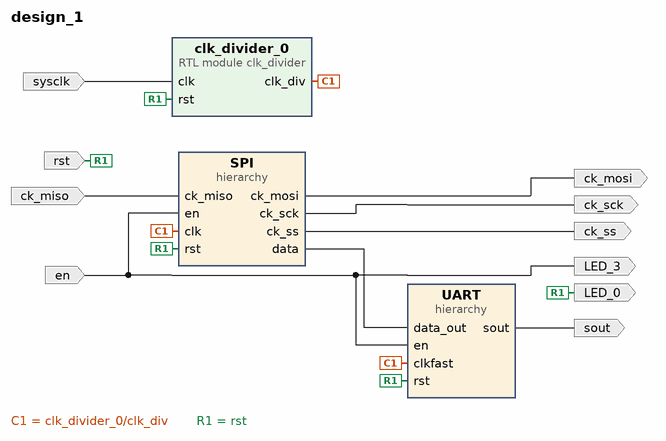
[diagram p0: block diagram of the top level]
# Vivado block design design_1, xc7z020clg400-1, Vivado 2021.1.1
create_bd_design design_1

create_bd_port -dir I -type clk sysclk
set_property -dict {CONFIG.FREQ_HZ 125000000} [get_bd_ports sysclk]
create_bd_port -dir I -type rst rst
set_property -dict {CONFIG.POLARITY ACTIVE_HIGH} [get_bd_ports rst]
create_bd_port -dir O -type data sout
create_bd_port -dir O LED_0
create_bd_port -dir I en
create_bd_port -dir O LED_3
create_bd_port -dir I ck_miso
create_bd_port -dir O ck_ss
create_bd_port -dir O ck_sck
create_bd_port -dir O ck_mosi

create_bd_cell -type module -reference clk_divider clk_divider_0
create_bd_cell -type hier UART
create_bd_cell -type hier SPI

# ---- hierarchy /UART ----
current_bd_instance /UART
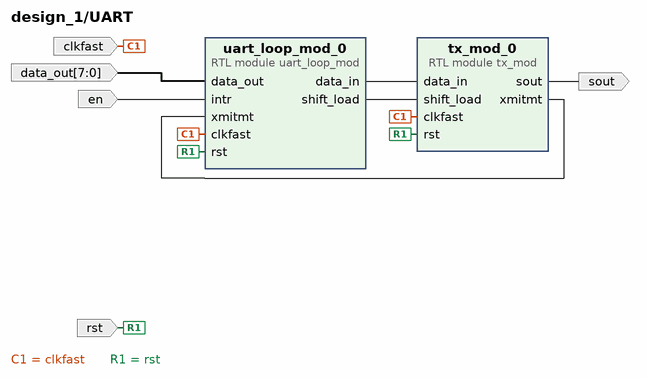
[diagram p1: block diagram inside /UART]
create_bd_pin -dir I clkfast
create_bd_pin -dir I -from 7 -to 0 data_out
create_bd_pin -dir I en
create_bd_pin -dir I -type rst rst
create_bd_pin -dir O sout

create_bd_cell -type module -reference uart_loop_mod uart_loop_mod_0
create_bd_cell -type module -reference tx_mod tx_mod_0

# ---- hierarchy /SPI ----
current_bd_instance /SPI
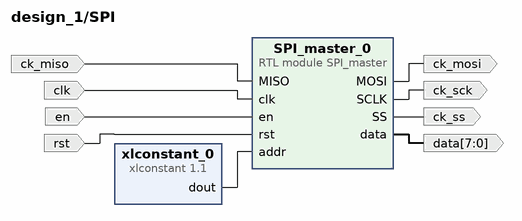
[diagram p2: block diagram inside /SPI]
create_bd_pin -dir I -type clk clk
create_bd_pin -dir I -type rst rst
create_bd_pin -dir I en
create_bd_pin -dir I ck_miso
create_bd_pin -dir O ck_mosi
create_bd_pin -dir O ck_sck
create_bd_pin -dir O ck_ss
create_bd_pin -dir O -from 7 -to 0 data

create_bd_cell -type module -reference SPI_master SPI_master_0
create_bd_cell -type ip -vlnv xilinx.com:ip:xlconstant:1.1 xlconstant_0
set_property -dict {CONFIG.CONST_VAL 51 CONFIG.CONST_WIDTH 8} [get_bd_cells xlconstant_0]

# ---- connections ----

current_bd_instance /UART
connect_bd_net -net SPI_master_0_data [get_bd_pins data_out] [get_bd_pins uart_loop_mod_0/data_out]
connect_bd_net -net clk_divider_0_clk_div [get_bd_pins clkfast] [get_bd_pins uart_loop_mod_0/clkfast] [get_bd_pins tx_mod_0/clkfast]
connect_bd_net -net en_0_1 [get_bd_pins en] [get_bd_pins uart_loop_mod_0/intr]
connect_bd_net [get_bd_pins rst] [get_bd_pins uart_loop_mod_0/rst] [get_bd_pins tx_mod_0/rst]
connect_bd_net [get_bd_pins tx_mod_0/sout] [get_bd_pins sout]
connect_bd_net [get_bd_pins tx_mod_0/xmitmt] [get_bd_pins uart_loop_mod_0/xmitmt]
connect_bd_net [get_bd_pins uart_loop_mod_0/data_in] [get_bd_pins tx_mod_0/data_in]
connect_bd_net [get_bd_pins uart_loop_mod_0/shift_load] [get_bd_pins tx_mod_0/shift_load]

current_bd_instance /SPI
connect_bd_net [get_bd_pins SPI_master_0/MOSI] [get_bd_pins ck_mosi]
connect_bd_net [get_bd_pins SPI_master_0/SCLK] [get_bd_pins ck_sck]
connect_bd_net [get_bd_pins SPI_master_0/SS] [get_bd_pins ck_ss]
connect_bd_net [get_bd_pins SPI_master_0/data] [get_bd_pins data]
connect_bd_net [get_bd_pins ck_miso] [get_bd_pins SPI_master_0/MISO]
connect_bd_net -net clk_divider_0_clk_div [get_bd_pins clk] [get_bd_pins SPI_master_0/clk]
connect_bd_net -net en_0_1 [get_bd_pins en] [get_bd_pins SPI_master_0/en]
connect_bd_net [get_bd_pins rst] [get_bd_pins SPI_master_0/rst]
connect_bd_net [get_bd_pins xlconstant_0/dout] [get_bd_pins SPI_master_0/addr]

current_bd_instance /
connect_bd_net -net SPI_master_0_MOSI [get_bd_pins SPI/ck_mosi] [get_bd_ports ck_mosi]
connect_bd_net -net SPI_master_0_SCLK [get_bd_pins SPI/ck_sck] [get_bd_ports ck_sck]
connect_bd_net -net SPI_master_0_SS [get_bd_pins SPI/ck_ss] [get_bd_ports ck_ss]
connect_bd_net -net SPI_master_0_data [get_bd_pins SPI/data] [get_bd_pins UART/data_out]
connect_bd_net [get_bd_ports ck_miso] [get_bd_pins SPI/ck_miso]
connect_bd_net [get_bd_pins clk_divider_0/clk_div] [get_bd_pins UART/clkfast] [get_bd_pins SPI/clk]
connect_bd_net -net en_0_1 [get_bd_ports en] [get_bd_ports LED_3] [get_bd_pins UART/en] [get_bd_pins SPI/en]
connect_bd_net [get_bd_ports rst] [get_bd_pins clk_divider_0/rst] [get_bd_ports LED_0] [get_bd_pins UART/rst] [get_bd_pins SPI/rst]
connect_bd_net [get_bd_ports sysclk] [get_bd_pins clk_divider_0/clk]
connect_bd_net -net tx_mod_0_sout [get_bd_pins UART/sout] [get_bd_ports sout]

validate_bd_design
save_bd_design
